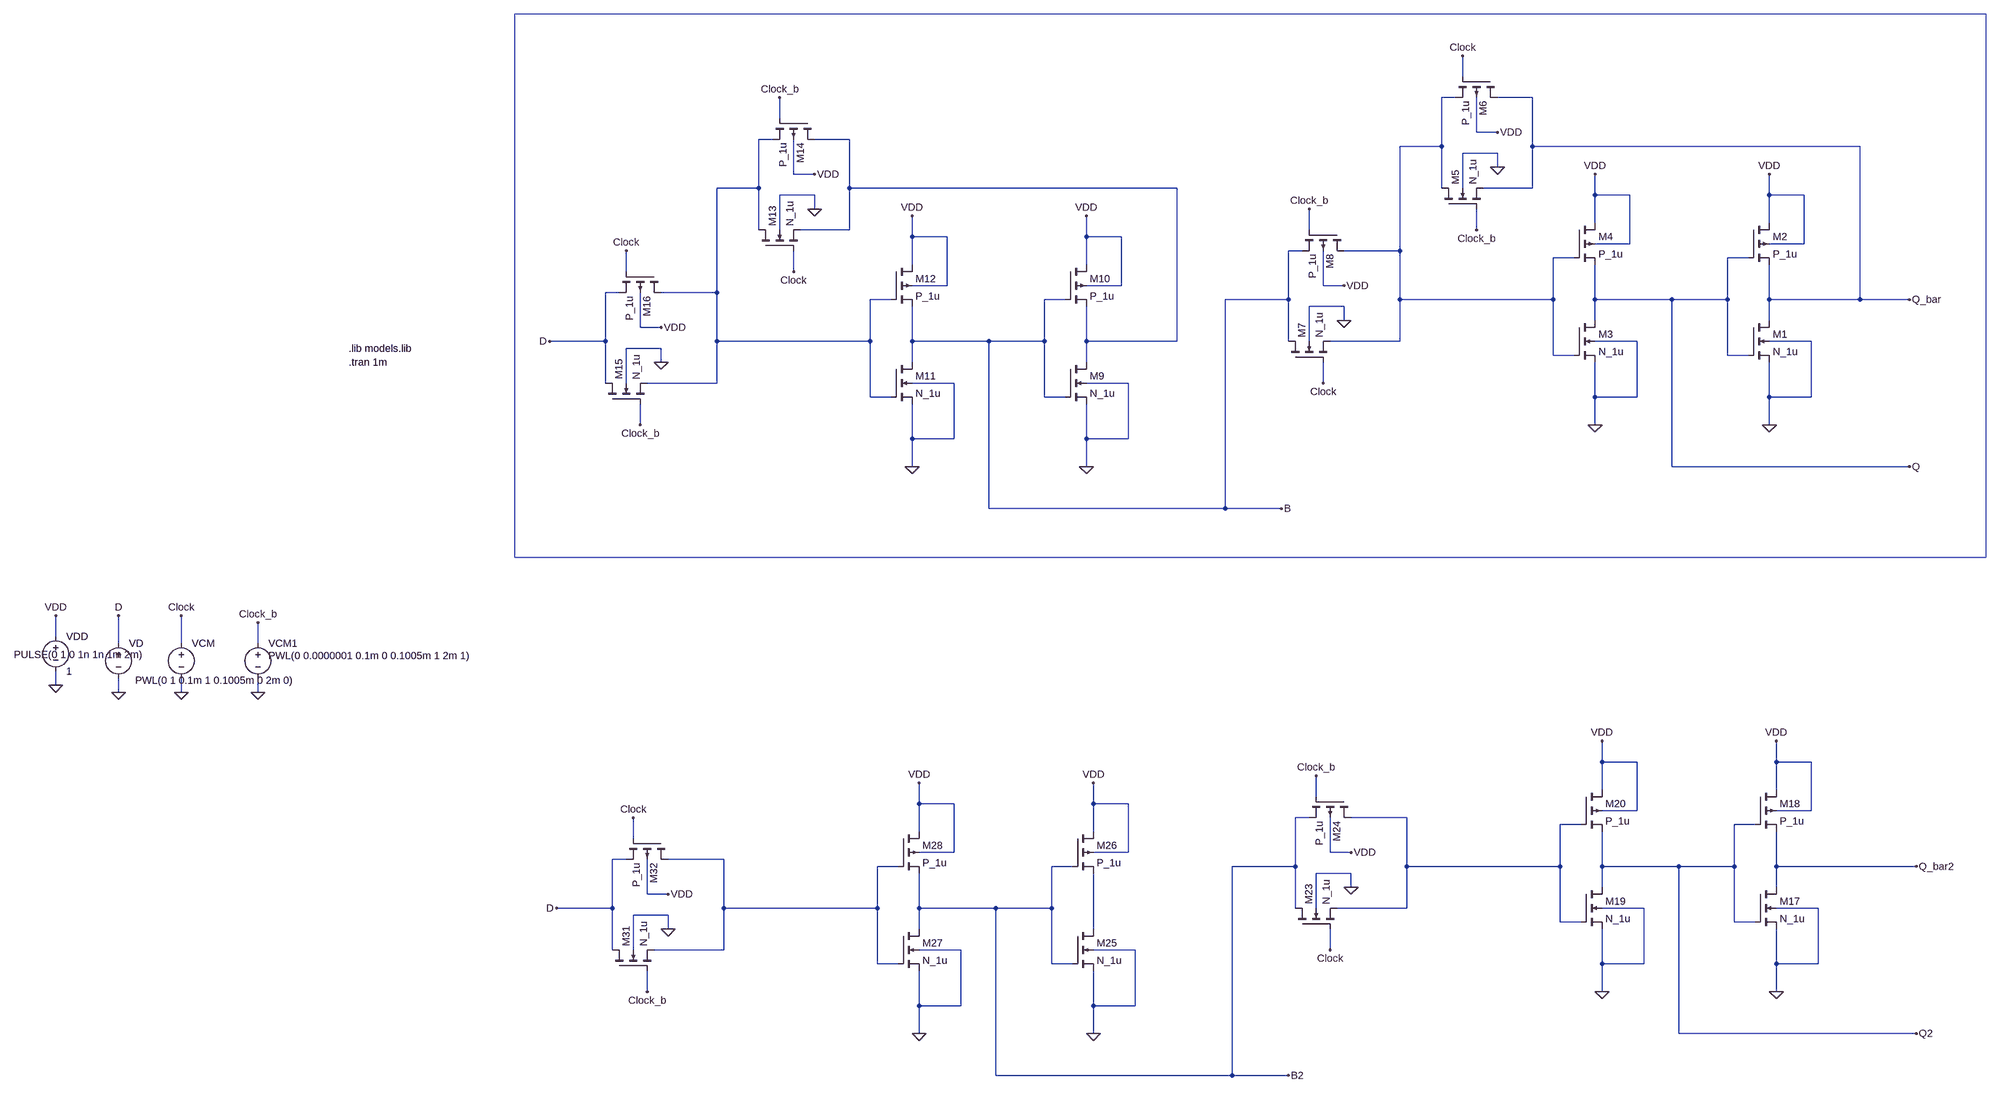
[diagram p0: schematic TP1_ej7.asc]
TP1_ej7.asc, the LTspice schematic file:
Version 4.1
SHEET 1 2084 2108
WIRE 832 -416 832 -464
WIRE 816 -368 784 -368
WIRE 992 -368 912 -368
WIRE -752 -320 -752 -368
WIRE 864 -288 864 -368
WIRE 912 -288 864 -288
WIRE -768 -272 -800 -272
WIRE -592 -272 -672 -272
WIRE 784 -256 784 -368
WIRE 784 -256 688 -256
WIRE 992 -256 992 -368
WIRE 1744 -256 992 -256
WIRE 912 -240 832 -240
WIRE 912 -208 912 -240
WIRE -720 -192 -720 -272
WIRE -672 -192 -720 -192
WIRE -800 -160 -800 -272
WIRE -800 -160 -896 -160
WIRE -592 -160 -592 -272
WIRE 160 -160 -592 -160
WIRE 784 -160 784 -256
WIRE 832 -160 832 -240
WIRE 992 -160 992 -256
WIRE 992 -160 880 -160
WIRE -672 -144 -752 -144
WIRE 1136 -144 1136 -192
WIRE 1216 -144 1136 -144
WIRE 1536 -144 1536 -192
WIRE 1616 -144 1536 -144
WIRE -672 -112 -672 -144
WIRE 1136 -80 1136 -144
WIRE 1536 -80 1536 -144
WIRE -800 -64 -800 -160
WIRE -752 -64 -752 -144
WIRE -592 -64 -592 -160
WIRE -592 -64 -704 -64
WIRE 480 -64 480 -112
WIRE 864 -64 864 -112
WIRE -448 -48 -448 -96
WIRE -368 -48 -448 -48
WIRE -48 -48 -48 -96
WIRE 32 -48 -48 -48
WIRE 1216 -32 1216 -144
WIRE 1216 -32 1136 -32
WIRE 1616 -32 1616 -144
WIRE 1616 -32 1536 -32
WIRE 464 -16 432 -16
WIRE 688 -16 688 -256
WIRE 688 -16 560 -16
WIRE 1088 0 1040 0
WIRE 1488 0 1440 0
WIRE -448 16 -448 -48
WIRE -48 16 -48 -48
WIRE -1104 32 -1104 -16
WIRE -720 32 -720 -16
WIRE -368 64 -368 -48
WIRE -368 64 -448 64
WIRE 32 64 32 -48
WIRE 32 64 -48 64
WIRE 512 64 512 -16
WIRE 560 64 512 64
WIRE -1120 80 -1152 80
WIRE -896 80 -896 -160
WIRE -896 80 -1024 80
WIRE -496 96 -544 96
WIRE -96 96 -144 96
WIRE 432 96 432 -16
WIRE 432 96 272 96
WIRE 688 96 688 -16
WIRE 1040 96 1040 0
WIRE 1040 96 688 96
WIRE 1136 96 1136 16
WIRE 1312 96 1136 96
WIRE 1440 96 1440 0
WIRE 1440 96 1312 96
WIRE 1536 96 1536 16
WIRE 1744 96 1744 -256
WIRE 1744 96 1536 96
WIRE 1904 96 1744 96
WIRE 560 112 480 112
WIRE 560 144 560 112
WIRE 1136 144 1136 96
WIRE 1536 144 1536 96
WIRE -1072 160 -1072 80
WIRE -1024 160 -1072 160
WIRE -1152 192 -1152 80
WIRE -1152 192 -1360 192
WIRE -896 192 -896 80
WIRE -544 192 -544 96
WIRE -544 192 -896 192
WIRE -448 192 -448 112
WIRE -272 192 -448 192
WIRE -144 192 -144 96
WIRE -144 192 -272 192
WIRE -48 192 -48 112
WIRE 160 192 160 -160
WIRE 160 192 -48 192
WIRE 432 192 432 96
WIRE 480 192 480 112
WIRE 688 192 688 96
WIRE 688 192 528 192
WIRE 1232 192 1136 192
WIRE 1632 192 1536 192
WIRE -1024 208 -1104 208
WIRE 1040 224 1040 96
WIRE 1088 224 1040 224
WIRE 1440 224 1440 96
WIRE 1488 224 1440 224
WIRE -1024 240 -1024 208
WIRE -448 240 -448 192
WIRE -48 240 -48 192
WIRE -1152 288 -1152 192
WIRE -1104 288 -1104 208
WIRE -896 288 -896 192
WIRE -896 288 -1056 288
WIRE -352 288 -448 288
WIRE 48 288 -48 288
WIRE 512 288 512 240
WIRE -544 320 -544 192
WIRE -496 320 -544 320
WIRE -144 320 -144 192
WIRE -96 320 -144 320
WIRE 1136 320 1136 240
WIRE 1232 320 1232 192
WIRE 1232 320 1136 320
WIRE 1536 320 1536 240
WIRE 1632 320 1632 192
WIRE 1632 320 1536 320
WIRE -1072 384 -1072 336
WIRE 1136 384 1136 320
WIRE 1536 384 1536 320
WIRE -448 416 -448 336
WIRE -352 416 -352 288
WIRE -352 416 -448 416
WIRE -48 416 -48 336
WIRE 48 416 48 288
WIRE 48 416 -48 416
WIRE -448 480 -448 416
WIRE -48 480 -48 416
WIRE 1312 480 1312 96
WIRE 1904 480 1312 480
WIRE -272 576 -272 192
WIRE 272 576 272 96
WIRE 272 576 -272 576
WIRE 416 576 272 576
WIRE -2800 1040 -2800 992
WIRE -2656 1056 -2656 992
WIRE -2512 1056 -2512 992
WIRE -2336 1056 -2336 1008
WIRE -2800 1152 -2800 1120
WIRE -2656 1168 -2656 1136
WIRE -2512 1168 -2512 1136
WIRE -2336 1168 -2336 1136
WIRE 1152 1328 1152 1280
WIRE 1232 1328 1152 1328
WIRE 1552 1328 1552 1280
WIRE 1632 1328 1552 1328
WIRE 1152 1392 1152 1328
WIRE 1552 1392 1552 1328
WIRE 496 1408 496 1360
WIRE -432 1424 -432 1376
WIRE -352 1424 -432 1424
WIRE -32 1424 -32 1376
WIRE 48 1424 -32 1424
WIRE 1232 1440 1232 1328
WIRE 1232 1440 1152 1440
WIRE 1632 1440 1632 1328
WIRE 1632 1440 1552 1440
WIRE 480 1456 448 1456
WIRE 704 1456 576 1456
WIRE 1104 1472 1056 1472
WIRE 1504 1472 1456 1472
WIRE -432 1488 -432 1424
WIRE -32 1488 -32 1424
WIRE -1088 1504 -1088 1456
WIRE -352 1536 -352 1424
WIRE -352 1536 -432 1536
WIRE 48 1536 48 1424
WIRE 48 1536 -32 1536
WIRE 528 1536 528 1456
WIRE 576 1536 528 1536
WIRE -1104 1552 -1136 1552
WIRE -880 1552 -1008 1552
WIRE -480 1568 -528 1568
WIRE -80 1568 -128 1568
WIRE 448 1568 448 1456
WIRE 448 1568 288 1568
WIRE 704 1568 704 1456
WIRE 1056 1568 1056 1472
WIRE 1056 1568 704 1568
WIRE 1152 1568 1152 1488
WIRE 1328 1568 1152 1568
WIRE 1456 1568 1456 1472
WIRE 1456 1568 1328 1568
WIRE 1552 1568 1552 1488
WIRE 1920 1568 1552 1568
WIRE 576 1584 496 1584
WIRE 576 1616 576 1584
WIRE 1152 1616 1152 1568
WIRE 1552 1616 1552 1568
WIRE -1056 1632 -1056 1552
WIRE -1008 1632 -1056 1632
WIRE -1136 1664 -1136 1552
WIRE -1136 1664 -1344 1664
WIRE -880 1664 -880 1552
WIRE -528 1664 -528 1568
WIRE -528 1664 -880 1664
WIRE -432 1664 -432 1584
WIRE -256 1664 -432 1664
WIRE -128 1664 -128 1568
WIRE -128 1664 -256 1664
WIRE 448 1664 448 1568
WIRE 496 1664 496 1584
WIRE 704 1664 704 1568
WIRE 704 1664 544 1664
WIRE 1248 1664 1152 1664
WIRE 1648 1664 1552 1664
WIRE -1008 1680 -1088 1680
WIRE 1056 1696 1056 1568
WIRE 1104 1696 1056 1696
WIRE 1456 1696 1456 1568
WIRE 1504 1696 1456 1696
WIRE -1008 1712 -1008 1680
WIRE -432 1712 -432 1664
WIRE -32 1712 -32 1584
WIRE -1136 1760 -1136 1664
WIRE -1088 1760 -1088 1680
WIRE -880 1760 -880 1664
WIRE -880 1760 -1040 1760
WIRE -336 1760 -432 1760
WIRE 64 1760 -32 1760
WIRE 528 1760 528 1712
WIRE -528 1792 -528 1664
WIRE -480 1792 -528 1792
WIRE -128 1792 -128 1664
WIRE -80 1792 -128 1792
WIRE 1152 1792 1152 1712
WIRE 1248 1792 1248 1664
WIRE 1248 1792 1152 1792
WIRE 1552 1792 1552 1712
WIRE 1648 1792 1648 1664
WIRE 1648 1792 1552 1792
WIRE -1056 1856 -1056 1808
WIRE 1152 1856 1152 1792
WIRE 1552 1856 1552 1792
WIRE -432 1888 -432 1808
WIRE -336 1888 -336 1760
WIRE -336 1888 -432 1888
WIRE -32 1888 -32 1808
WIRE 64 1888 64 1760
WIRE 64 1888 -32 1888
WIRE -432 1952 -432 1888
WIRE -32 1952 -32 1888
WIRE 1328 1952 1328 1568
WIRE 1920 1952 1328 1952
WIRE -256 2048 -256 1664
WIRE 288 2048 288 1568
WIRE 288 2048 -256 2048
WIRE 432 2048 288 2048
FLAG -2800 1152 0
FLAG -2800 992 VDD
FLAG 1536 384 0
FLAG 1536 -192 VDD
FLAG 1904 96 Q_bar
FLAG 1136 384 0
FLAG 1136 -192 VDD
FLAG 912 -288 VDD
FLAG 912 -208 0
FLAG 832 -464 Clock
FLAG 864 -64 Clock_b
FLAG 1904 480 Q
FLAG 560 64 VDD
FLAG 560 144 0
FLAG 480 -112 Clock_b
FLAG 512 288 Clock
FLAG -48 480 0
FLAG -48 -96 VDD
FLAG -448 480 0
FLAG -448 -96 VDD
FLAG -672 -192 VDD
FLAG -672 -112 0
FLAG -752 -368 Clock_b
FLAG -720 32 Clock
FLAG -1024 160 VDD
FLAG -1024 240 0
FLAG -1104 -16 Clock
FLAG -1072 384 Clock_b
FLAG 416 576 B
FLAG -1360 192 D
FLAG -2656 1168 0
FLAG -2512 1168 0
FLAG -2336 1008 Clock_b
FLAG -2512 992 Clock
FLAG -2656 992 D
FLAG -2336 1168 0
FLAG 1552 1856 0
FLAG 1552 1280 VDD
FLAG 1920 1568 Q_bar2
FLAG 1152 1856 0
FLAG 1152 1280 VDD
FLAG 1920 1952 Q2
FLAG 576 1536 VDD
FLAG 576 1616 0
FLAG 496 1360 Clock_b
FLAG 528 1760 Clock
FLAG -32 1952 0
FLAG -32 1376 VDD
FLAG -432 1952 0
FLAG -432 1376 VDD
FLAG -1008 1632 VDD
FLAG -1008 1712 0
FLAG -1088 1456 Clock
FLAG -1056 1856 Clock_b
FLAG 432 2048 B2
FLAG -1344 1664 D
SYMBOL voltage -2800 1024 R0
SYMATTR InstName VDD
SYMATTR Value 1
SYMBOL voltage -2512 1040 R0
WINDOW 123 24 92 Left 2
WINDOW 39 0 0 Left 0
WINDOW 3 -106 101 Left 2
SYMATTR Value PWL(0 1 0.1m 1 0.1005m 0 2m 0)
SYMATTR InstName VCM
SYMBOL nmos4 1488 144 R0
SYMATTR InstName M1
SYMATTR Value N_1u
SYMATTR Value2 l=1u w=2u
SYMBOL pmos4 1488 -80 R0
SYMATTR InstName M2
SYMATTR Value2 l=1u w=4.83u
SYMATTR Value P_1u
SYMBOL nmos4 1088 144 R0
SYMATTR InstName M3
SYMATTR Value N_1u
SYMATTR Value2 l=1u w=2u
SYMBOL pmos4 1088 -80 R0
SYMATTR InstName M4
SYMATTR Value2 l=1u w=4.83u
SYMATTR Value P_1u
SYMBOL nmos4 784 -112 R270
SYMATTR InstName M5
SYMATTR Value N_1u
SYMATTR Value2 l=1u w=2u
SYMBOL pmos4 912 -416 R90
SYMATTR InstName M6
SYMATTR Value2 l=1u w=4.83u
SYMATTR Value P_1u
SYMBOL nmos4 432 240 R270
SYMATTR InstName M7
SYMATTR Value N_1u
SYMATTR Value2 l=1u w=2u
SYMBOL pmos4 560 -64 R90
SYMATTR InstName M8
SYMATTR Value2 l=1u w=4.83u
SYMATTR Value P_1u
SYMBOL nmos4 -96 240 R0
SYMATTR InstName M9
SYMATTR Value N_1u
SYMATTR Value2 l=1u w=2u
SYMBOL pmos4 -96 16 R0
SYMATTR InstName M10
SYMATTR Value2 l=1u w=4.83u
SYMATTR Value P_1u
SYMBOL nmos4 -496 240 R0
SYMATTR InstName M11
SYMATTR Value N_1u
SYMATTR Value2 l=1u w=2u
SYMBOL pmos4 -496 16 R0
SYMATTR InstName M12
SYMATTR Value2 l=1u w=4.83u
SYMATTR Value P_1u
SYMBOL nmos4 -800 -16 R270
SYMATTR InstName M13
SYMATTR Value N_1u
SYMATTR Value2 l=1u w=2u
SYMBOL pmos4 -672 -320 R90
SYMATTR InstName M14
SYMATTR Value2 l=1u w=4.83u
SYMATTR Value P_1u
SYMBOL nmos4 -1152 336 R270
SYMATTR InstName M15
SYMATTR Value N_1u
SYMATTR Value2 l=1u w=2u
SYMBOL pmos4 -1024 32 R90
SYMATTR InstName M16
SYMATTR Value2 l=1u w=4.83u
SYMATTR Value P_1u
SYMBOL voltage -2656 1040 R0
WINDOW 3 -240 42 Left 2
WINDOW 123 0 0 Left 0
WINDOW 39 0 0 Left 0
SYMATTR Value PULSE(0 1 0 1n 1n 1m 2m)
SYMATTR InstName VD
SYMBOL voltage -2336 1040 R0
WINDOW 123 24 92 Left 2
WINDOW 39 0 0 Left 0
WINDOW 3 24 44 Left 2
SYMATTR Value PWL(0 0.0000001 0.1m 0 0.1005m 1 2m 1)
SYMATTR InstName VCM1
SYMBOL nmos4 1504 1616 R0
SYMATTR InstName M17
SYMATTR Value N_1u
SYMATTR Value2 l=1u w=2u
SYMBOL pmos4 1504 1392 R0
SYMATTR InstName M18
SYMATTR Value2 l=1u w=4.83u
SYMATTR Value P_1u
SYMBOL nmos4 1104 1616 R0
SYMATTR InstName M19
SYMATTR Value N_1u
SYMATTR Value2 l=1u w=2u
SYMBOL pmos4 1104 1392 R0
SYMATTR InstName M20
SYMATTR Value2 l=1u w=4.83u
SYMATTR Value P_1u
SYMBOL nmos4 448 1712 R270
SYMATTR InstName M23
SYMATTR Value N_1u
SYMATTR Value2 l=1u w=2u
SYMBOL pmos4 576 1408 R90
SYMATTR InstName M24
SYMATTR Value2 l=1u w=4.83u
SYMATTR Value P_1u
SYMBOL nmos4 -80 1712 R0
SYMATTR InstName M25
SYMATTR Value N_1u
SYMATTR Value2 l=1u w=2u
SYMBOL pmos4 -80 1488 R0
SYMATTR InstName M26
SYMATTR Value2 l=1u w=4.83u
SYMATTR Value P_1u
SYMBOL nmos4 -480 1712 R0
SYMATTR InstName M27
SYMATTR Value N_1u
SYMATTR Value2 l=1u w=2u
SYMBOL pmos4 -480 1488 R0
SYMATTR InstName M28
SYMATTR Value2 l=1u w=4.83u
SYMATTR Value P_1u
SYMBOL nmos4 -1136 1808 R270
SYMATTR InstName M31
SYMATTR Value N_1u
SYMATTR Value2 l=1u w=2u
SYMBOL pmos4 -1008 1504 R90
SYMATTR InstName M32
SYMATTR Value2 l=1u w=4.83u
SYMATTR Value P_1u
TEXT -2128 208 Left 2 !.lib models.lib
TEXT -2128 240 Left 2 !.tran 1m
RECTANGLE Normal 2080 -560 -1440 688

The netlist it stands for:
* TP1_ej7.asc
VDD VDD 0 1
VCM Clock 0 PWL(0 1 0.1m 1 0.1005m 0 2m 0)
M1 Q_bar Q 0 0 N_1u l=1u w=2u
M2 VDD Q Q_bar VDD P_1u l=1u w=4.83u
M3 Q N001 0 0 N_1u l=1u w=2u
M4 VDD N001 Q VDD P_1u l=1u w=4.83u
M5 N001 Clock_b Q_bar 0 N_1u l=1u w=2u
M6 Q_bar Clock N001 VDD P_1u l=1u w=4.83u
M7 B Clock N001 0 N_1u l=1u w=2u
M8 N001 Clock_b B VDD P_1u l=1u w=4.83u
M9 N003 B 0 0 N_1u l=1u w=2u
M10 VDD B N003 VDD P_1u l=1u w=4.83u
M11 B N002 0 0 N_1u l=1u w=2u
M12 VDD N002 B VDD P_1u l=1u w=4.83u
M13 N002 Clock N003 0 N_1u l=1u w=2u
M14 N003 Clock_b N002 VDD P_1u l=1u w=4.83u
M15 D Clock_b N002 0 N_1u l=1u w=2u
M16 N002 Clock D VDD P_1u l=1u w=4.83u
VD D 0 PULSE(0 1 0 1n 1n 1m 2m)
VCM1 Clock_b 0 PWL(0 0.0000001 0.1m 0 0.1005m 1 2m 1)
M17 Q_bar2 Q2 0 0 N_1u l=1u w=2u
M18 VDD Q2 Q_bar2 VDD P_1u l=1u w=4.83u
M19 Q2 N004 0 0 N_1u l=1u w=2u
M20 VDD N004 Q2 VDD P_1u l=1u w=4.83u
M23 B2 Clock N004 0 N_1u l=1u w=2u
M24 N004 Clock_b B2 VDD P_1u l=1u w=4.83u
M25 N006 B2 0 0 N_1u l=1u w=2u
M26 VDD B2 N006 VDD P_1u l=1u w=4.83u
M27 B2 N005 0 0 N_1u l=1u w=2u
M28 VDD N005 B2 VDD P_1u l=1u w=4.83u
M31 D Clock_b N005 0 N_1u l=1u w=2u
M32 N005 Clock D VDD P_1u l=1u w=4.83u
.model NMOS NMOS
.model PMOS PMOS
.lib standard.mos
.lib models.lib
.tran 1m
.backanno
.end